# EAGLE schematic E-P-206-R2.0.0_Fuel_Cell_Controller (EAGLE 7.7.0)

## Sheet 1 of 3: Connectors
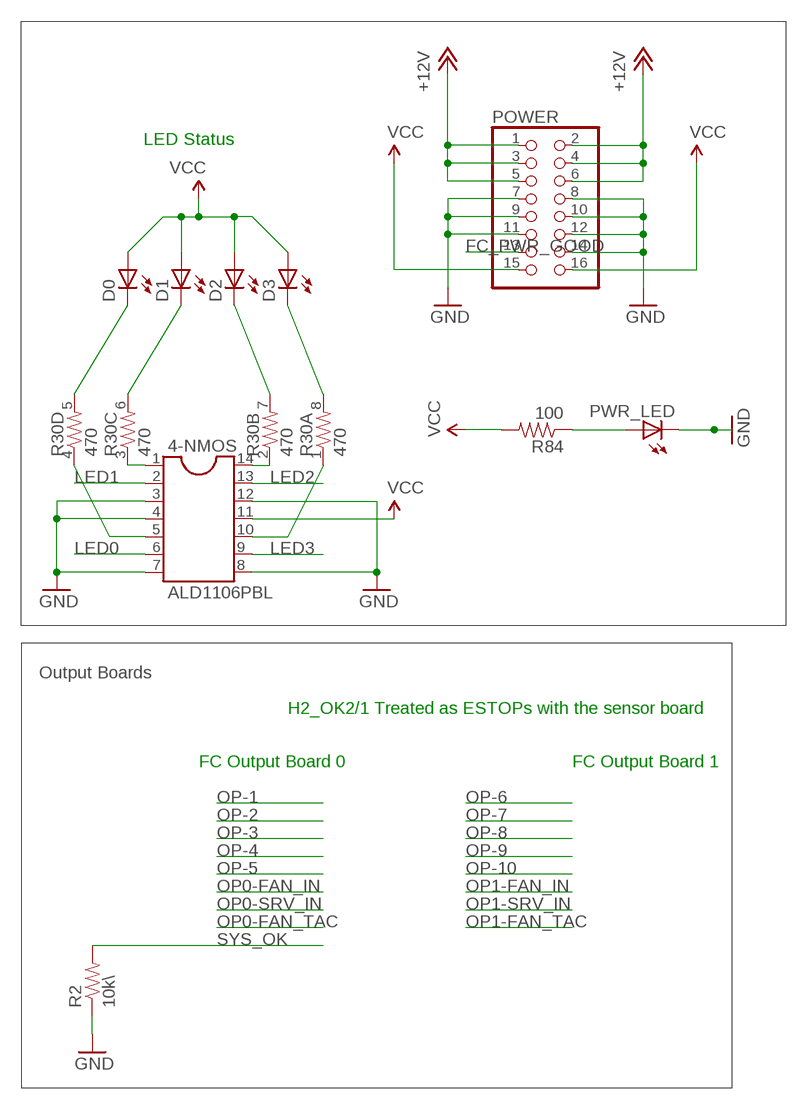
[diagram p0: schematic, sheet 1]

### Parts
4-NMOS  ALD1106PBL  DIL14SOIC  [SOIC-14]
D0  LED1206  [LED-1206]
D1  LED1206  [LED-1206]
D2  LED1206  [LED-1206]
D3  LED1206  [LED-1206]
POWER  PINHD-2X8  [2X08]
PWR_LED  LED1206  [LED-1206]
R2  10k\  RESISTOR0603-RES  [0603-RES]
R30  470  RESISTOR-ARRAY0603-ARV  [0603-ARV]
R84  100  RESISTOR0603-RES  [0603-RES]

### Nets
+12V: POWER.1 POWER.2 POWER.3 POWER.4 POWER.5 POWER.6 ; also sheet 2,3
FC_PWR_GOOD: POWER.13
GND: 4-NMOS.3 4-NMOS.4 4-NMOS.7 4-NMOS.8 4-NMOS.12 POWER.7 POWER.8 POWER.9 POWER.10 POWER.11 POWER.12 POWER.14 PWR_LED.C R2.1 ; also sheet 2,3
LED0: 4-NMOS.6 ; also sheet 2
LED0_O: D0.C R30.5
LED1: 4-NMOS.2 ; also sheet 2
LED1_O: D1.C R30.6
LED2: 4-NMOS.13 ; also sheet 2
LED2_O: D2.C R30.7
LED3: 4-NMOS.9 ; also sheet 2
LED3_O: D3.C R30.8
N$2: 4-NMOS.5 R30.4
N$4: 4-NMOS.1 R30.3
N$7: 4-NMOS.14 R30.2
N$8: 4-NMOS.10 R30.1
N$17: PWR_LED.A R84.1
SYS_OK: R2.2 ; also sheet 2,3
VCC: 4-NMOS.11 D0.A D1.A D2.A D3.A POWER.15 POWER.16 R84.2 ; also sheet 2,3

### Notes on the sheet
- LED Status
- Output Boards
- H2_OK2/1 Treated as ESTOPs with the sensor board
- FC Output Board 0 | FC Output Board 1

## Sheet 2 of 3: MCU
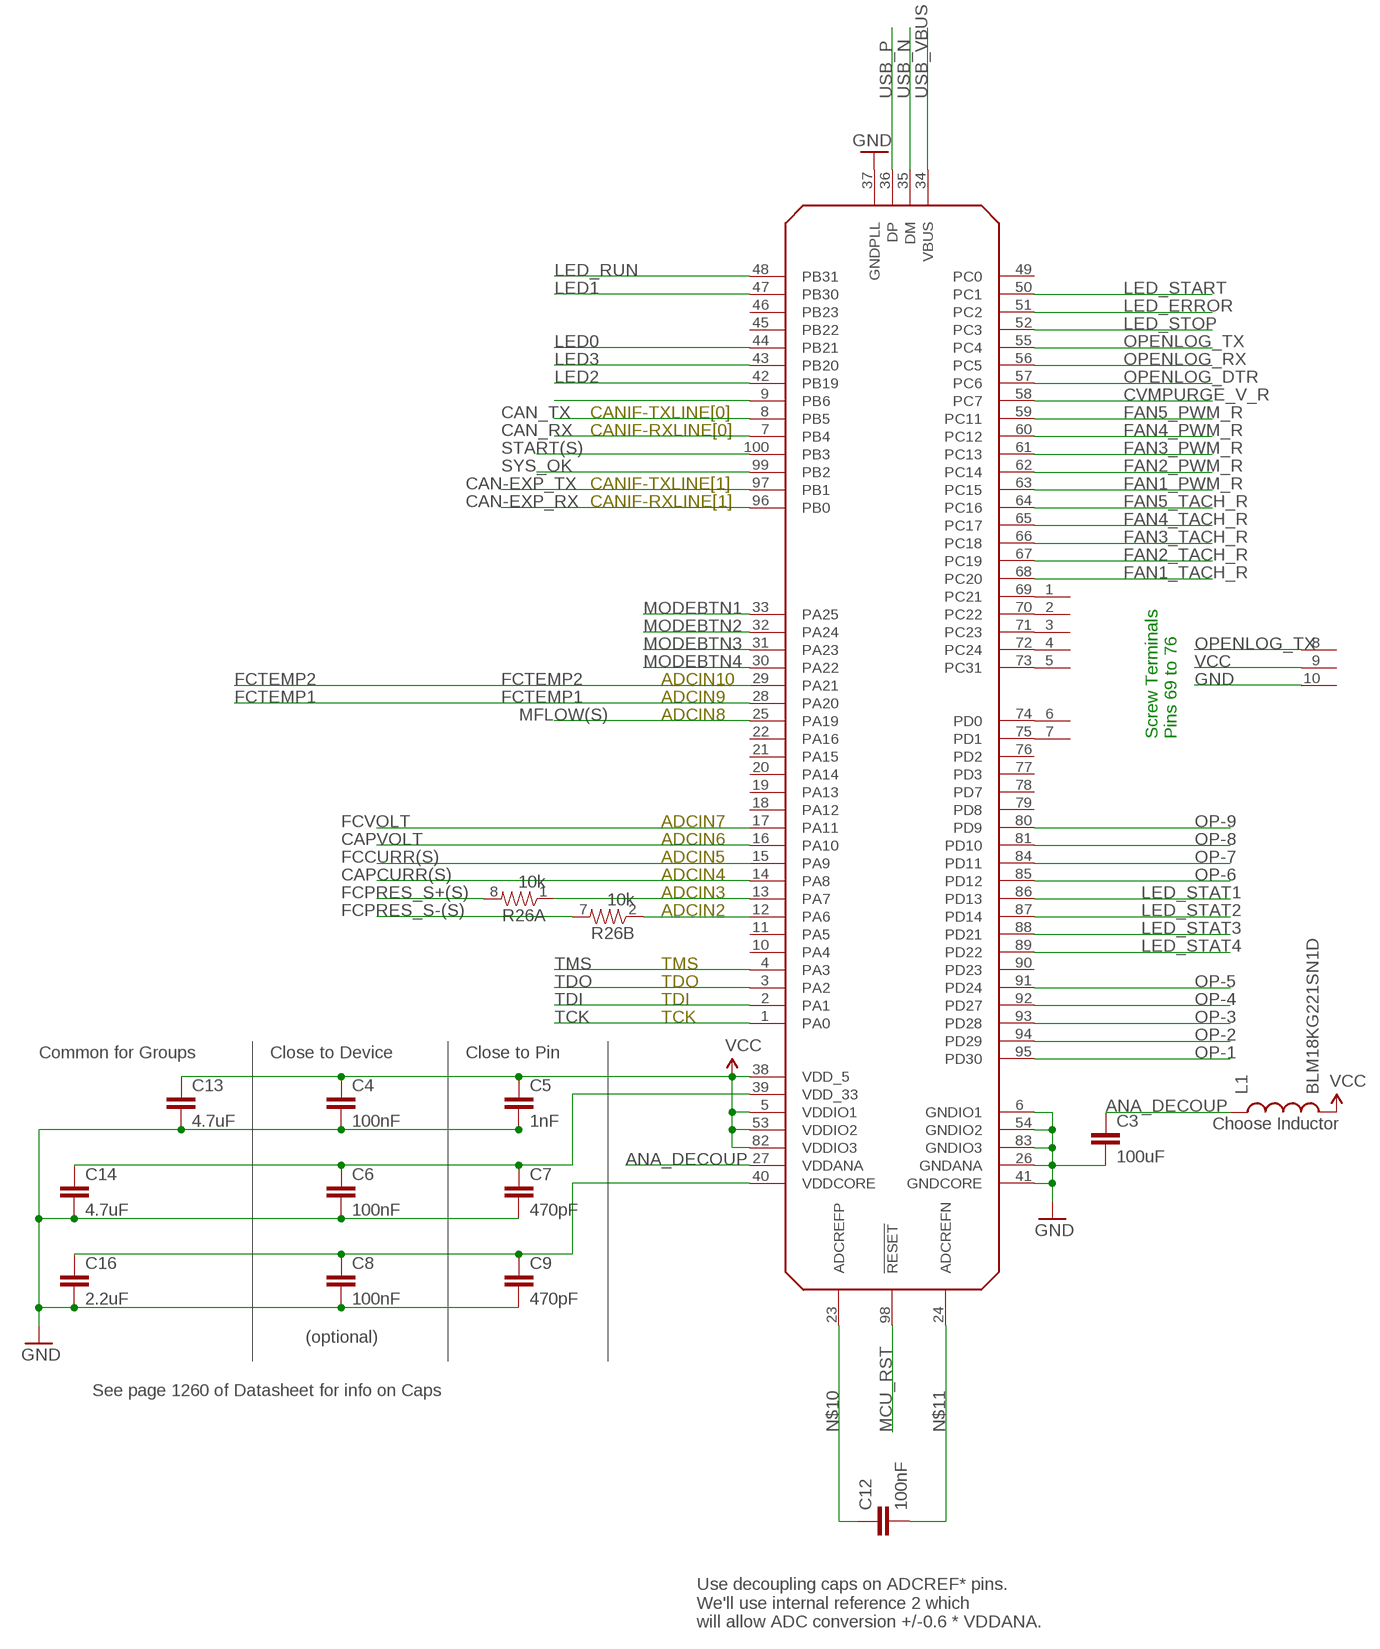
[diagram p1: schematic, sheet 2, part 1 of 2]
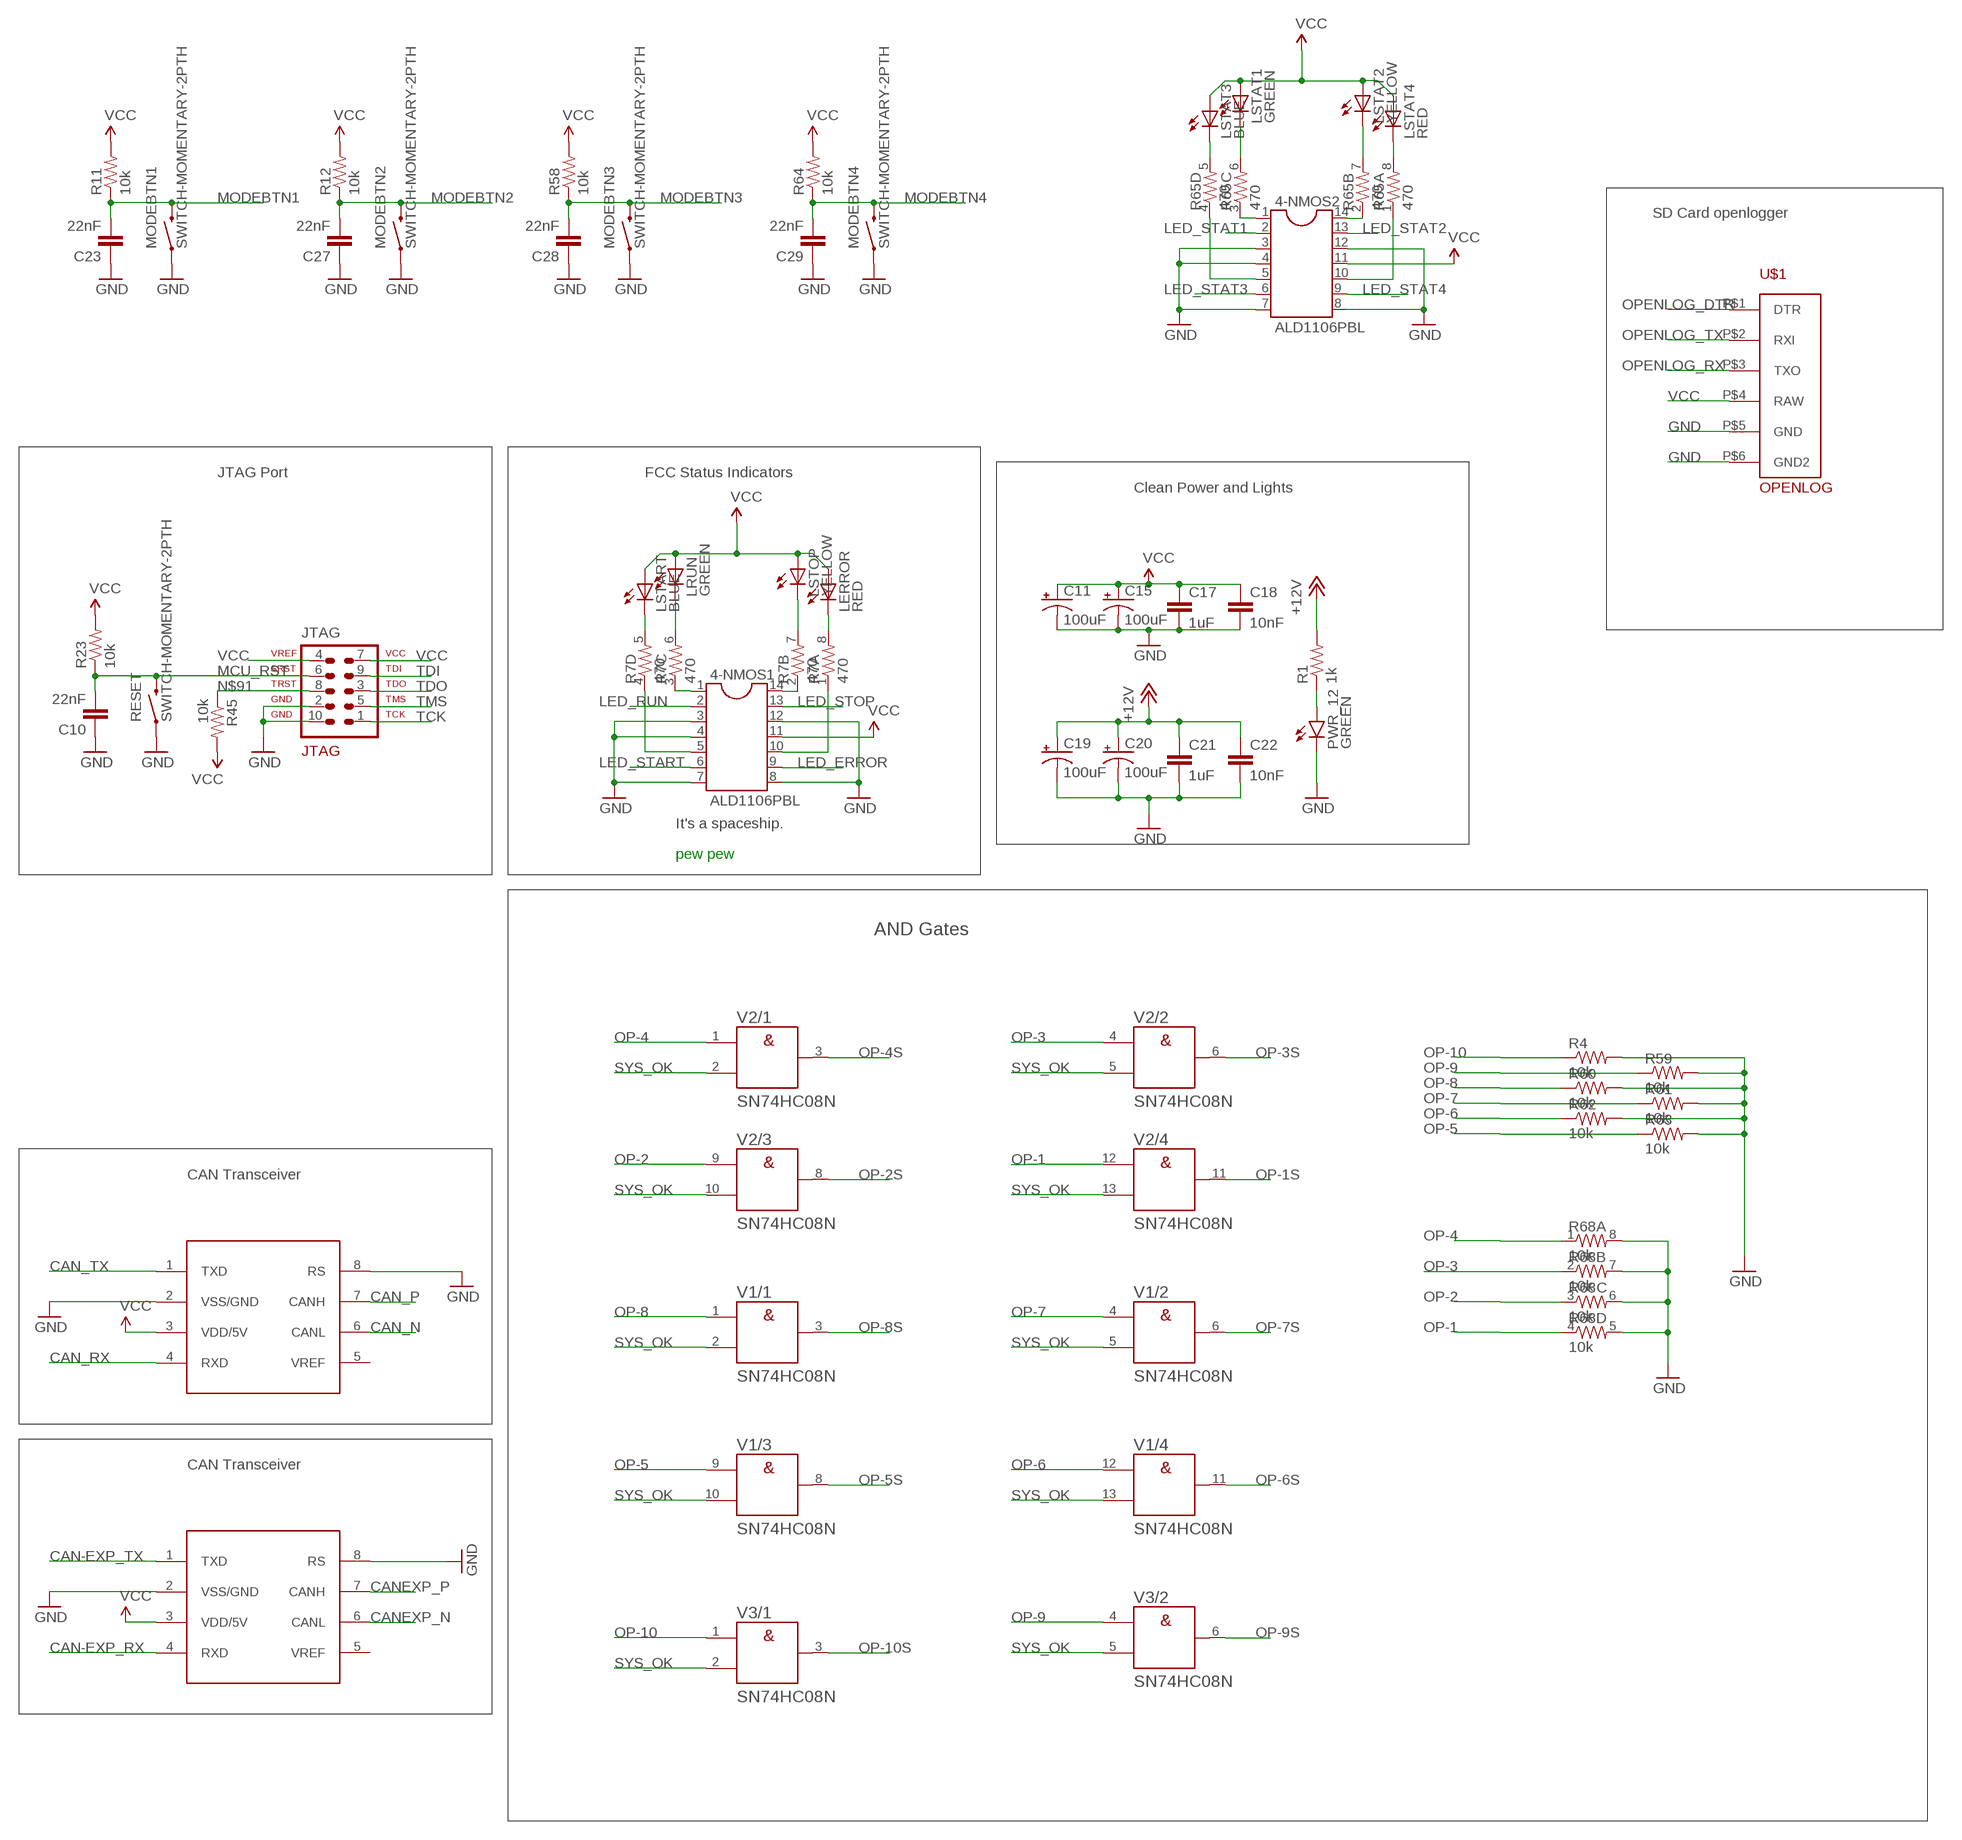
[diagram p2: schematic, sheet 2, part 2 of 2]

### Parts
4-NMOS1  ALD1106PBL  DIL14SOIC  [SOIC-14]
4-NMOS2  ALD1106PBL  DIL14SOIC  [SOIC-14]
C3  100uF  CAP0805  [0805]
C4  100nF  CAP0603-CAP  [0603-CAP]
C5  1nF  CAP0603-CAP  [0603-CAP]
C6  100nF  CAP0603-CAP  [0603-CAP]
C7  470pF  CAP0603-CAP  [0603-CAP]
C8  100nF  CAP0603-CAP  [0603-CAP]
C9  470pF  CAP0603-CAP  [0603-CAP]
C10  22nF  CAP0603-CAP  [0603-CAP]
C11  100uF  CAP_POLC  [PANASONIC_C]
C12  100nF  CAP0805  [0805]
C13  4.7uF  CAP0805  [0805]
C14  4.7uF  CAP0805  [0805]
C15  100uF  CAP_POLC  [PANASONIC_C]
C16  2.2uF  CAP0805  [0805]
C17  1uF  CAP0805  [0805]
C18  10nF  CAP0603-CAP  [0603-CAP]
C19  100uF  CAP_POLC  [PANASONIC_C]
C20  100uF  CAP_POLC  [PANASONIC_C]
C21  1uF  CAP0805  [0805]
C22  10nF  CAP0603-CAP  [0603-CAP]
C23  22nF  CAP0603-CAP  [0603-CAP]
C27  22nF  CAP0603-CAP  [0603-CAP]
C28  22nF  CAP0603-CAP  [0603-CAP]
C29  22nF  CAP0603-CAP  [0603-CAP]
JTAG  2x5  AVR-JTAG-10  [AVR-JTAG-10]
L1  BLM18KG221SN1D  INDUCTOR0603  [0603]
LERROR  RED  LED1206  [LED-1206]
LRUN  GREEN  LED1206  [LED-1206]
LSTART  BLUE  LED1206  [LED-1206]
LSTAT1  GREEN  LED1206  [LED-1206]
LSTAT2  YELLOW  LED1206  [LED-1206]
LSTAT3  BLUE  LED1206  [LED-1206]
LSTAT4  RED  LED1206  [LED-1206]
LSTOP  YELLOW  LED1206  [LED-1206]
MCU  AT32UC3C1512  [TQFP100]
MODEBTN1  SWITCH-MOMENTARY-2PTH  [TACTILE-PTH]
MODEBTN2  SWITCH-MOMENTARY-2PTH  [TACTILE-PTH]
MODEBTN3  SWITCH-MOMENTARY-2PTH  [TACTILE-PTH]
MODEBTN4  SWITCH-MOMENTARY-2PTH  [TACTILE-PTH]
PWR_12  GREEN  LED1206  [LED-1206]
R1  1k  RESISTOR0603-RES  [0603-RES]
R4  10k  RESISTOR0603-RES  [0603-RES]
R7  470  RESISTOR-ARRAY0603-ARV  [0603-ARV]
R11  10k  RESISTOR0603-RES  [0603-RES]
R12  10k  RESISTOR0603-RES  [0603-RES]
R23  10k  RESISTOR0603-RES  [0603-RES]
R26  10k  RESISTOR-ARRAY0603-ARV  [0603-ARV]
R45  10k  RESISTOR0603-RES  [0603-RES]
R58  10k  RESISTOR0603-RES  [0603-RES]
R59  10k  RESISTOR0603-RES  [0603-RES]
R60  10k  RESISTOR0603-RES  [0603-RES]
R61  10k  RESISTOR0603-RES  [0603-RES]
R62  10k  RESISTOR0603-RES  [0603-RES]
R63  10k  RESISTOR0603-RES  [0603-RES]
R64  10k  RESISTOR0603-RES  [0603-RES]
R65  470  RESISTOR-ARRAY0603-ARV  [0603-ARV]
R68  10k  RESISTOR-ARRAY0603-ARV  [0603-ARV]
RESET  SWITCH-MOMENTARY-2PTH  [TACTILE-PTH]
U$1  OPENLOG  [OPENLOG]
U$2  10X1PCBBLOCK  [10X1PCBBLOCK]
U$4  MCP2551  MCP2551SOIC  [8-SOIC]
U$36  MCP2551  MCP2551SOIC  [8-SOIC]
V1  SN74HC08N  7408N  [DIL14]
V2  SN74HC08N  7408N  [DIL14]
V3  SN74HC08N  7408N  [DIL14]

### Nets
+12V: C19.+ C20.+ C21.1 C22.1 R1.2 ; also sheet 1,3
ANA_DECOUP: C3.1 L1.1 MCU.27(VDDANA)
CAN-EXP_RX: MCU.96(PB0) U$36.4(RXD)
CAN-EXP_TX: MCU.97(PB1) U$36.1(TXD)
CAN_N: U$4.6(CANL)
CAN_P: U$4.7(CANH)
CAN_RX: MCU.7(PB4) U$4.4(RXD)
CAN_TX: MCU.8(PB5) U$4.1(TXD)
CANEXP_N: U$36.6(CANL)
CANEXP_P: U$36.7(CANH)
CAPCURR(S): MCU.14(PA8) ; also sheet 3
CAPVOLT: MCU.16(PA10) ; also sheet 3
CVMPURGE_V_R: MCU.58(PC7) ; also sheet 3
FAN1_PWM_R: MCU.63(PC15) ; also sheet 3
FAN1_TACH_R: MCU.68(PC20) ; also sheet 3
FAN2_PWM_R: MCU.62(PC14) ; also sheet 3
FAN2_TACH_R: MCU.67(PC19) ; also sheet 3
FAN3_PWM_R: MCU.61(PC13) ; also sheet 3
FAN3_TACH_R: MCU.66(PC18) ; also sheet 3
FAN4_PWM_R: MCU.60(PC12) ; also sheet 3
FAN4_TACH_R: MCU.65(PC17) ; also sheet 3
FAN5_PWM_R: MCU.59(PC11) ; also sheet 3
FAN5_TACH_R: MCU.64(PC16) ; also sheet 3
FCCURR(S): MCU.15(PA9) ; also sheet 3
FCPRES_S+(S): R26.8 ; also sheet 3
FCPRES_S-(S): R26.7 ; also sheet 3
FCTEMP1: MCU.28(PA20) ; also sheet 3
FCTEMP2: MCU.29(PA21) ; also sheet 3
FCVOLT: MCU.17(PA11) ; also sheet 3
GND: 4-NMOS1.3 4-NMOS1.4 4-NMOS1.7 4-NMOS1.8 4-NMOS1.12 4-NMOS2.8 4-NMOS2.12 C3.2 C4.2 C5.2 C6.2 C7.2 C8.2 C9.2 C10.1 C11.- C13.2 C14.2 C15.- C16.2 C17.2 C18.2 C19.- C20.- C21.2 C22.2 C23.1 C27.1 C28.1 C29.1 JTAG.2 JTAG.10 MCU.6(GNDIO1) MCU.26(GNDANA) MCU.37(GNDPLL) MCU.41(GNDCORE) MCU.54(GNDIO2) MCU.83(GNDIO3) MODEBTN1.1 MODEBTN2.1 MODEBTN3.1 MODEBTN4.1 PWR_12.C R4.2 R59.2 R60.2 R61.2 R62.2 R63.2 R68.5 R68.6 R68.7 R68.8 RESET.1 U$1.P$5(GND) U$1.P$6(GND2) U$2.10 U$4.2(VSS/GND) U$4.8(RS) U$36.2(VSS/GND) U$36.8(RS) ; also sheet 1,3
LED0: MCU.44(PB21) ; also sheet 1
LED1: MCU.47(PB30) ; also sheet 1
LED2: MCU.42(PB19) ; also sheet 1
LED3: MCU.43(PB20) ; also sheet 1
LED_ERROR: 4-NMOS1.9 MCU.51(PC2)
LED_RUN: 4-NMOS1.2 MCU.48(PB31)
LED_START: 4-NMOS1.6 MCU.50(PC1)
LED_STAT1: 4-NMOS2.2 MCU.86(PD13)
LED_STAT2: 4-NMOS2.13 MCU.87(PD14)
LED_STAT3: 4-NMOS2.3 4-NMOS2.4 4-NMOS2.6 4-NMOS2.7 MCU.88(PD21) ; supply symbol labelled GND
LED_STAT4: 4-NMOS2.9 MCU.89(PD22)
LED_STOP: 4-NMOS1.13 MCU.52(PC3)
MCU_RST: C10.2 JTAG.6 MCU.98(!RESET) R23.1 RESET.3 ; also sheet 3
MFLOW(S): MCU.25(PA19) ; also sheet 3
MODEBTN1: C23.2 MCU.33(PA25) MODEBTN1.3 R11.1
MODEBTN2: C27.2 MCU.32(PA24) MODEBTN2.3 R12.1
MODEBTN3: C28.2 MCU.31(PA23) MODEBTN3.3 R58.1
MODEBTN4: C29.2 MCU.30(PA22) MODEBTN4.3 R64.1
N$3: MCU.12(PA6) R26.2
N$5: MCU.13(PA7) R26.1
N$6: C6.1 C7.1 C14.1 MCU.39(VDD_33)
N$9: C8.1 C9.1 C16.1 MCU.40(VDDCORE)
N$10: C12.1 MCU.23(ADCREFP)
N$11: C12.2 MCU.24(ADCREFN)
N$22: MCU.69(PC21) U$2.1
N$23: MCU.70(PC22) U$2.2
N$24: MCU.71(PC23) U$2.3
N$25: LSTART.C R7.5
N$26: LRUN.C R7.6
N$30: MCU.72(PC24) U$2.4
N$31: MCU.73(PC31) U$2.5
N$32: 4-NMOS1.5 R7.4
N$33: 4-NMOS1.1 R7.3
N$34: PWR_12.A R1.1
N$36: MCU.74(PD0) U$2.6
N$37: MCU.75(PD1) U$2.7
N$39: 4-NMOS2.5 R65.4
N$40: 4-NMOS2.1 R65.3
N$41: 4-NMOS2.14 R65.2
N$42: 4-NMOS2.10 R65.1
N$43: LSTAT3.C R65.5
N$44: 4-NMOS1.14 R7.2
N$45: 4-NMOS1.10 R7.1
N$46: LSTOP.C R7.7
N$47: LERROR.C R7.8
N$50: LSTAT1.C R65.6
N$52: LSTAT2.C R65.7
N$55: LSTAT4.C R65.8
N$66: MCU.9(PB6)
N$91: JTAG.8 R45.1
OP-1: MCU.95(PD30) R68.4 V2.12(/4:A) ; also sheet 1
OP-1S: V2.11(/4:Y) ; also sheet 3
OP-2: MCU.94(PD29) R68.3 V2.9(/3:A) ; also sheet 1
OP-2S: V2.8(/3:Y) ; also sheet 3
OP-3: MCU.93(PD28) R68.2 V2.4(/2:A) ; also sheet 1
OP-3S: V2.6(/2:Y) ; also sheet 3
OP-4: MCU.92(PD27) R68.1 V2.1(/1:A) ; also sheet 1
OP-4S: V2.3(/1:Y) ; also sheet 3
OP-5: MCU.91(PD24) R63.1 V1.9(/3:A) ; also sheet 1
OP-5S: V1.8(/3:Y) ; also sheet 3
OP-6: MCU.85(PD12) R62.1 V1.12(/4:A) ; also sheet 1
OP-6S: V1.11(/4:Y) ; also sheet 3
OP-7: MCU.84(PD11) R61.1 V1.4(/2:A) ; also sheet 1
OP-7S: V1.6(/2:Y) ; also sheet 3
OP-8: MCU.81(PD10) R60.1 V1.1(/1:A) ; also sheet 1
OP-8S: V1.3(/1:Y) ; also sheet 3
OP-9: MCU.80(PD9) R59.1 V3.4(/2:A) ; also sheet 1
OP-9S: V3.6(/2:Y) ; also sheet 3
OP-10: R4.1 V3.1(/1:A) ; also sheet 1
OP-10S: V3.3(/1:Y) ; also sheet 3
OPENLOG_DTR: MCU.57(PC6) U$1.P$1(DTR)
OPENLOG_RX: MCU.56(PC5) U$1.P$3(TXO)
OPENLOG_TX: MCU.55(PC4) U$1.P$2(RXI) U$2.8
START(S): MCU.100(PB3) ; also sheet 3
SYS_OK: MCU.99(PB2) V1.2(/1:B) V1.5(/2:B) V1.10(/3:B) V1.13(/4:B) V2.2(/1:B) V2.5(/2:B) V2.10(/3:B) V2.13(/4:B) V3.2(/1:B) V3.5(/2:B) ; also sheet 1,3
TCK: JTAG.1 MCU.1(PA0)
TDI: JTAG.9 MCU.2(PA1)
TDO: JTAG.3 MCU.3(PA2)
TMS: JTAG.5 MCU.4(PA3)
USB_N: MCU.35(DM)
USB_P: MCU.36(DP)
USB_VBUS: MCU.34(VBUS)
VCC: 4-NMOS1.11 4-NMOS2.11 C4.1 C5.1 C11.+ C13.1 C15.+ C17.1 C18.1 JTAG.4 JTAG.7 L1.2 LERROR.A LRUN.A LSTART.A LSTAT1.A LSTAT2.A LSTAT3.A LSTAT4.A LSTOP.A MCU.5(VDDIO1) MCU.38(VDD_5) MCU.53(VDDIO2) MCU.82(VDDIO3) R11.2 R12.2 R23.2 R45.2 R58.2 R64.2 U$1.P$4(RAW) U$2.9 U$4.3(VDD/5V) U$36.3(VDD/5V) ; also sheet 1,3
Unconnected: MCU.10(PA4) MCU.11(PA5) MCU.18(PA12) MCU.19(PA13) MCU.20(PA14) MCU.21(PA15) MCU.22(PA16) MCU.45(PB22) MCU.46(PB23) MCU.49(PC0) MCU.76(PD2) MCU.77(PD3) MCU.78(PD7) MCU.79(PD8) MCU.90(PD23) R26.3 R26.4 R26.5 R26.6 U$4.5(VREF) U$36.5(VREF) V3.8(/3:Y) V3.9(/3:A) V3.10(/3:B) V3.11(/4:Y) V3.12(/4:A) V3.13(/4:B)

### Notes on the sheet
- SD Card openlogger
- JTAG Port | FCC Status Indicators
- Clean Power and Lights
- CANIF-TXLINE[0]
- CANIF-RXLINE[0]
- It's a spaceship.
- CANIF-TXLINE[1] | pew pew
- CANIF-RXLINE[1]
- AND Gates
- ADCIN10
- ADCIN9
- ADCIN8
- Screw Terminals
  Pins 69 to 76
- ADCIN7
- ADCIN6
- ADCIN5 | CAN Transceiver
- ADCIN4
- ADCIN3
- ADCIN2
- TMS
- TDO
- TDI
- TCK
- Common for Groups | Close to Device | Close to Pin
- Choose Inductor
- CAN Transceiver
- (optional)
- See page 1260 of Datasheet for info on Caps
- Use decoupling caps on ADCREF* pins.
  We'll use internal reference 2 which 
  will allow ADC conversion +/-0.6 * VDDANA.

## Sheet 3 of 3: Ethernet I/O
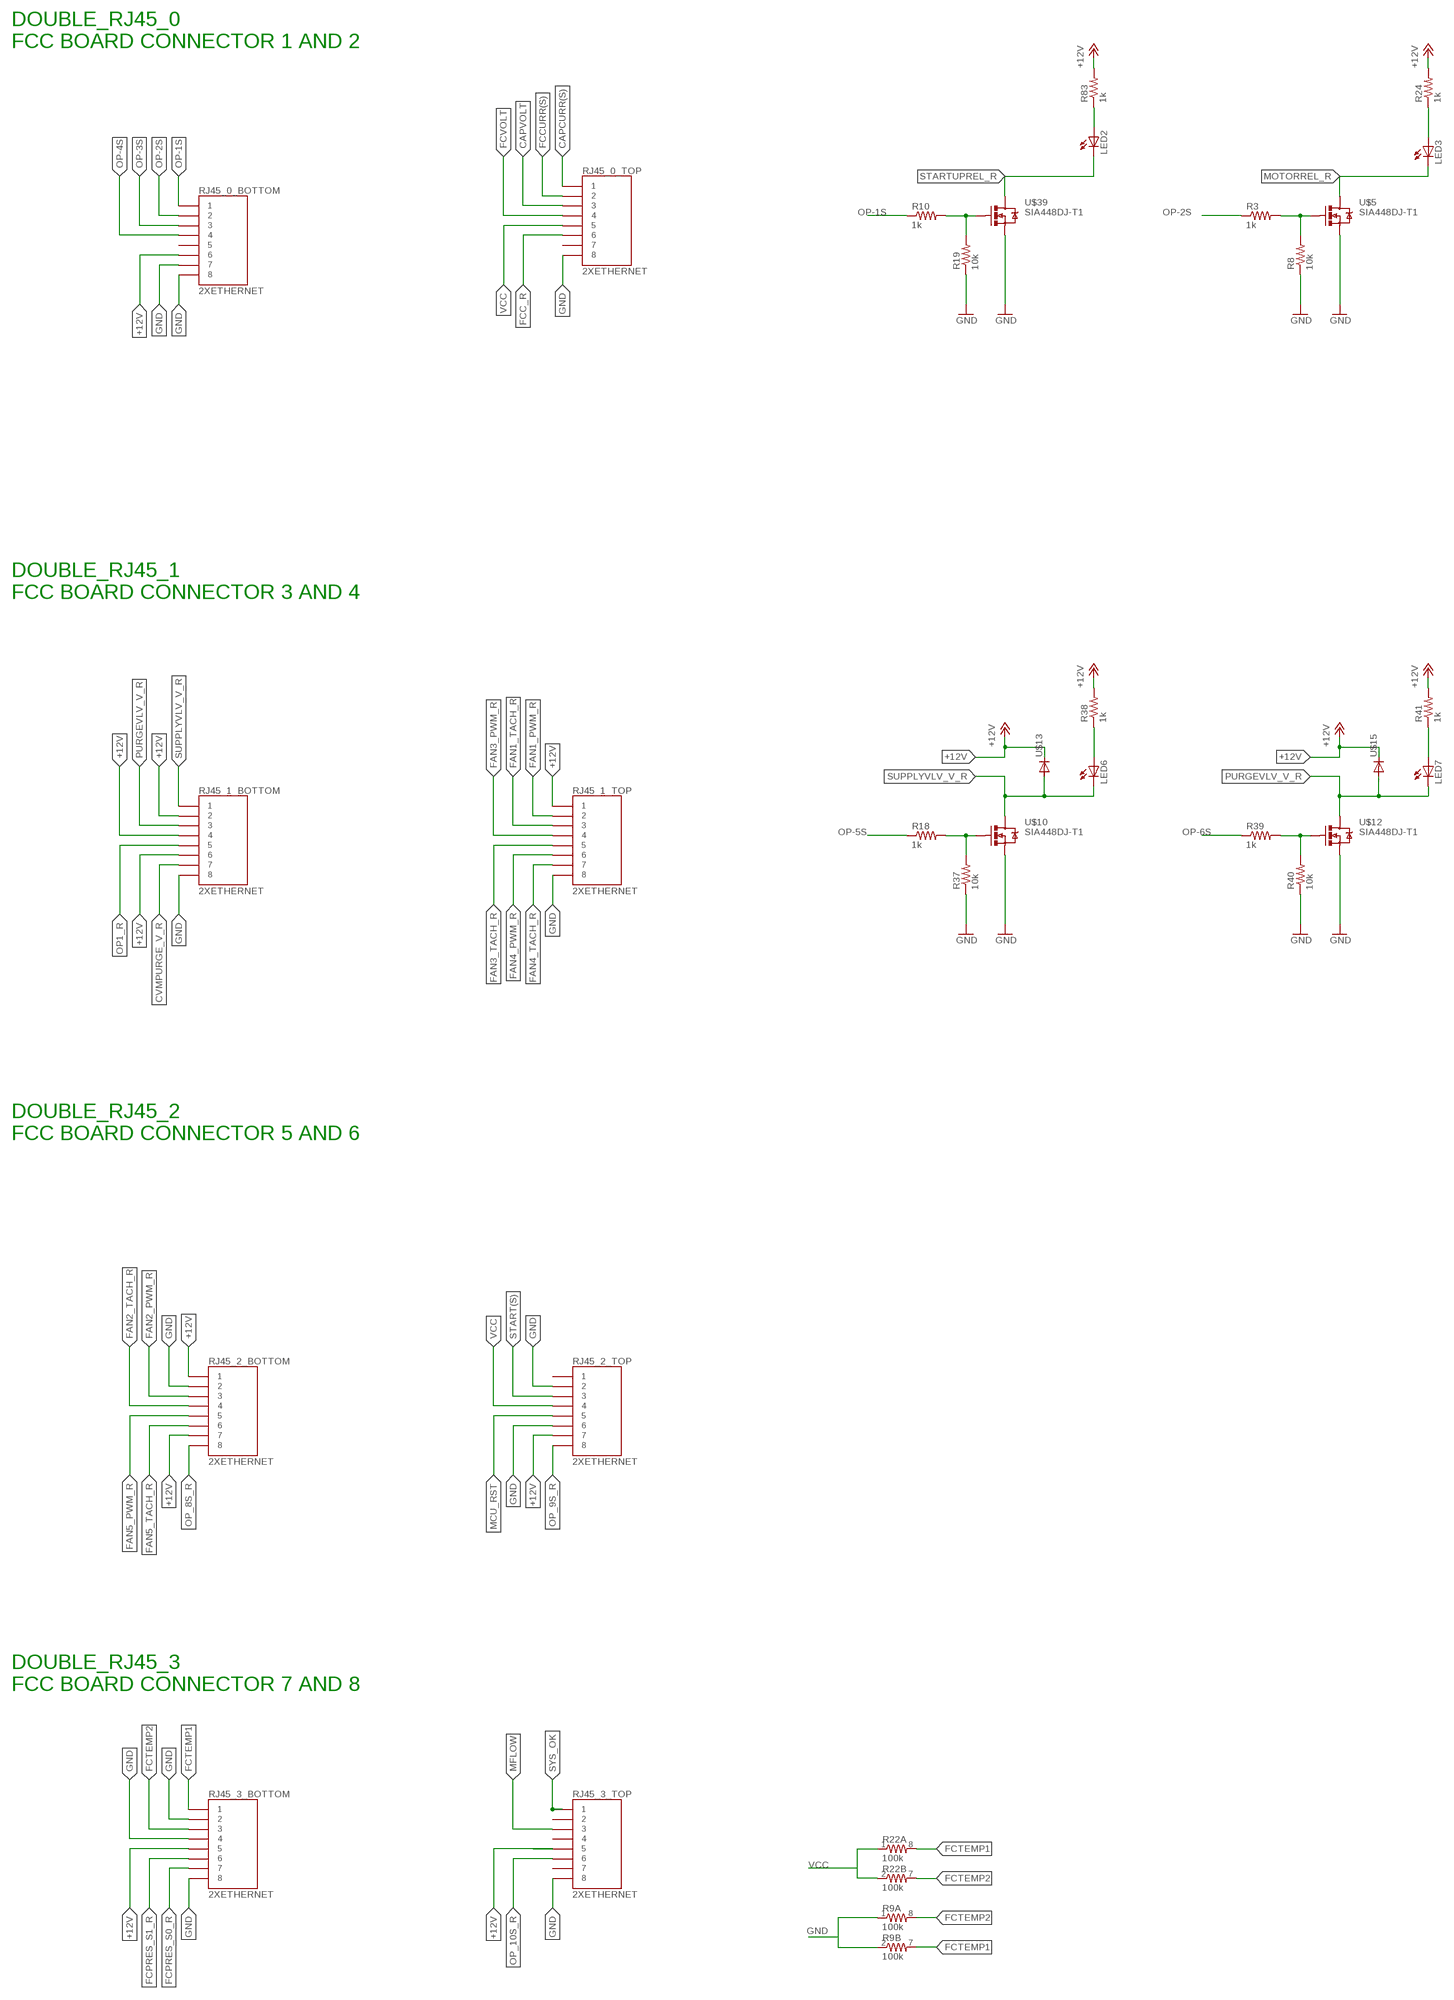
[diagram p3: schematic, sheet 3, part 1 of 2]
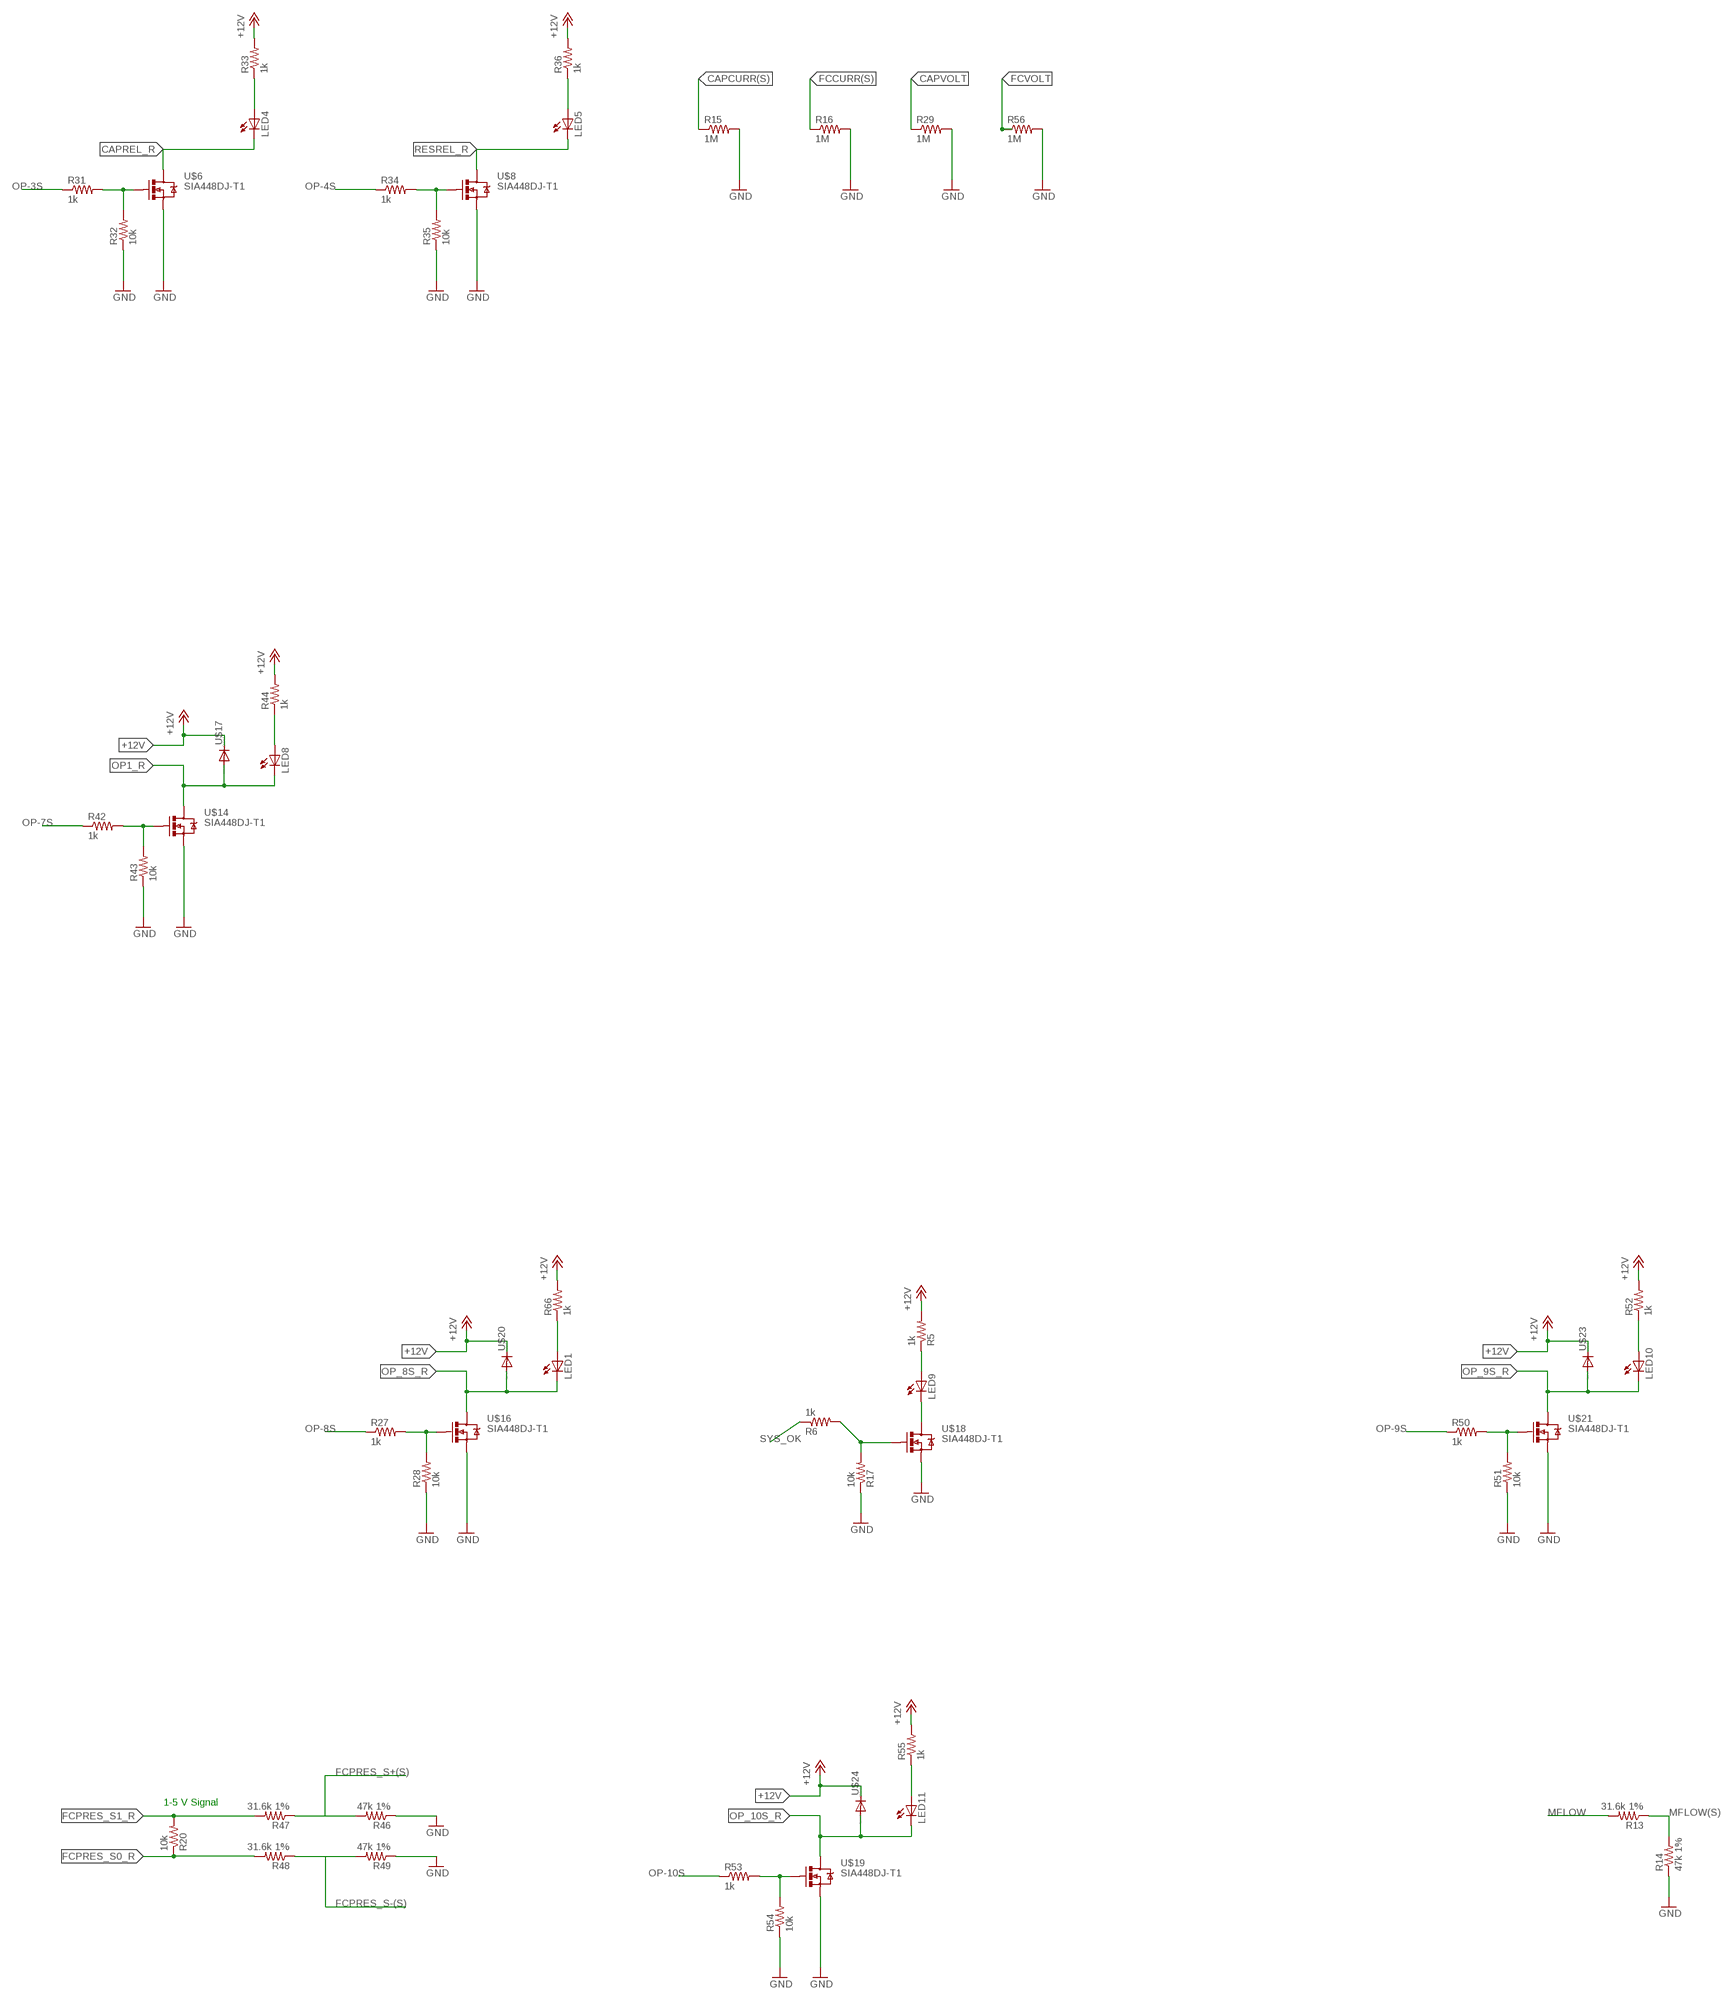
[diagram p4: schematic, sheet 3, part 2 of 2]

### Parts
LED1  LED1206  [LED-1206]
LED2  LED1206  [LED-1206]
LED3  LED1206  [LED-1206]
LED4  LED1206  [LED-1206]
LED5  LED1206  [LED-1206]
LED6  LED1206  [LED-1206]
LED7  LED1206  [LED-1206]
LED8  LED1206  [LED-1206]
LED9  LED1206  [LED-1206]
LED10  LED1206  [LED-1206]
LED11  LED1206  [LED-1206]
R3  1k  RESISTOR0603-RES  [0603-RES]
R5  1k  RESISTOR0603-RES  [0603-RES]
R6  1k  RESISTOR0603-RES  [0603-RES]
R8  10k  RESISTOR0603-RES  [0603-RES]
R9  100k  RESISTOR-ARRAY0603-ARV  [0603-ARV]
R10  1k  RESISTOR0603-RES  [0603-RES]
R13  31.6k 1%  RESISTOR0603-RES  [0603-RES]
R14  47k 1%  RESISTOR0603-RES  [0603-RES]
R15  1M  R-US_R0805  [R0805]
R16  1M  R-US_R0805  [R0805]
R17  10k  RESISTOR0603-RES  [0603-RES]
R18  1k  RESISTOR0603-RES  [0603-RES]
R19  10k  RESISTOR0603-RES  [0603-RES]
R20  10k  RESISTOR0603-RES  [0603-RES]
R22  100k  RESISTOR-ARRAY0603-ARV  [0603-ARV]
R24  1k  RESISTOR0603-RES  [0603-RES]
R27  1k  RESISTOR0603-RES  [0603-RES]
R28  10k  RESISTOR0603-RES  [0603-RES]
R29  1M  R-US_R0805  [R0805]
R31  1k  RESISTOR0603-RES  [0603-RES]
R32  10k  RESISTOR0603-RES  [0603-RES]
R33  1k  RESISTOR0603-RES  [0603-RES]
R34  1k  RESISTOR0603-RES  [0603-RES]
R35  10k  RESISTOR0603-RES  [0603-RES]
R36  1k  RESISTOR0603-RES  [0603-RES]
R37  10k  RESISTOR0603-RES  [0603-RES]
R38  1k  RESISTOR0603-RES  [0603-RES]
R39  1k  RESISTOR0603-RES  [0603-RES]
R40  10k  RESISTOR0603-RES  [0603-RES]
R41  1k  RESISTOR0603-RES  [0603-RES]
R42  1k  RESISTOR0603-RES  [0603-RES]
R43  10k  RESISTOR0603-RES  [0603-RES]
R44  1k  RESISTOR0603-RES  [0603-RES]
R46  47k 1%  RESISTOR0603-RES  [0603-RES]
R47  31.6k 1%  RESISTOR0603-RES  [0603-RES]
R48  31.6k 1%  RESISTOR0603-RES  [0603-RES]
R49  47k 1%  RESISTOR0603-RES  [0603-RES]
R50  1k  RESISTOR0603-RES  [0603-RES]
R51  10k  RESISTOR0603-RES  [0603-RES]
R52  1k  RESISTOR0603-RES  [0603-RES]
R53  1k  RESISTOR0603-RES  [0603-RES]
R54  10k  RESISTOR0603-RES  [0603-RES]
R55  1k  RESISTOR0603-RES  [0603-RES]
R56  1M  R-US_R0805  [R0805]
R66  1k  RESISTOR0603-RES  [0603-RES]
R83  1k  RESISTOR0603-RES  [0603-RES]
RJ45_0_  2XETHERNET  [2XETHERNET]
RJ45_1_  2XETHERNET  [2XETHERNET]
RJ45_2_  2XETHERNET  [2XETHERNET]
RJ45_3_  2XETHERNET  [2XETHERNET]
U$5  SIA448DJ-T1  SIA426DJ  [SC70-6L]
U$6  SIA448DJ-T1  SIA426DJ  [SC70-6L]
U$8  SIA448DJ-T1  SIA426DJ  [SC70-6L]
U$10  SIA448DJ-T1  SIA426DJ  [SC70-6L]
U$12  SIA448DJ-T1  SIA426DJ  [SC70-6L]
U$13  DIODE-DO214AC  [DO214AC]
U$14  SIA448DJ-T1  SIA426DJ  [SC70-6L]
U$15  DIODE-DO214AC  [DO214AC]
U$16  SIA448DJ-T1  SIA426DJ  [SC70-6L]
U$17  DIODE-DO214AC  [DO214AC]
U$18  SIA448DJ-T1  SIA426DJ  [SC70-6L]
U$19  SIA448DJ-T1  SIA426DJ  [SC70-6L]
U$20  DIODE-DO214AC  [DO214AC]
U$21  SIA448DJ-T1  SIA426DJ  [SC70-6L]
U$23  DIODE-DO214AC  [DO214AC]
U$24  DIODE-DO214AC  [DO214AC]
U$39  SIA448DJ-T1  SIA426DJ  [SC70-6L]

### Nets
+12V: R5.2 R24.2 R33.2 R36.2 R38.2 R41.2 R44.2 R52.2 R55.2 R66.2 R83.2 RJ45_0_.B_6 RJ45_1_.B_2 RJ45_1_.B_4 RJ45_1_.B_6 RJ45_1_.T_1 RJ45_2_.B_1 RJ45_2_.B_7 RJ45_2_.T_7 RJ45_3_.B_5 RJ45_3_.T_5 U$13.C U$15.C U$17.C U$20.C U$23.C U$24.C ; also sheet 1,2
CAPCURR(S): R15.1 RJ45_0_.T_1 ; also sheet 2
CAPREL_R: LED4.C U$6.D
CAPVOLT: R29.1 RJ45_0_.T_3 ; also sheet 2
CVMPURGE_V_R: RJ45_1_.B_7 ; also sheet 2
FAN1_PWM_R: RJ45_1_.T_2 ; also sheet 2
FAN1_TACH_R: RJ45_1_.T_3 ; also sheet 2
FAN2_PWM_R: RJ45_2_.B_3 ; also sheet 2
FAN2_TACH_R: RJ45_2_.B_4 ; also sheet 2
FAN3_PWM_R: RJ45_1_.T_4 ; also sheet 2
FAN3_TACH_R: RJ45_1_.T_5 ; also sheet 2
FAN4_PWM_R: RJ45_1_.T_6 ; also sheet 2
FAN4_TACH_R: RJ45_1_.T_7 ; also sheet 2
FAN5_PWM_R: RJ45_2_.B_5 ; also sheet 2
FAN5_TACH_R: RJ45_2_.B_6 ; also sheet 2
FCC_R: RJ45_0_.T_6
FCCURR(S): R16.1 RJ45_0_.T_2 ; also sheet 2
FCPRES_S0_R: R20.1 R48.2 RJ45_3_.B_7
FCPRES_S1_R: R20.2 R47.2 RJ45_3_.B_6
FCPRES_S+(S): R46.2 R47.1 ; also sheet 2
FCPRES_S-(S): R48.1 R49.2 ; also sheet 2
FCTEMP1: R9.7 R22.8 RJ45_3_.B_1 ; also sheet 2
FCTEMP2: R9.8 R22.7 RJ45_3_.B_3 ; also sheet 2
FCVOLT: R56.1 RJ45_0_.T_4 ; also sheet 2
GND: R8.1 R9.1 R9.2 R14.1 R15.2 R16.2 R17.1 R19.1 R28.1 R29.2 R32.1 R35.1 R37.1 R40.1 R43.1 R46.1 R49.1 R51.1 R54.1 R56.2 RJ45_0_.B_7 RJ45_0_.B_8 RJ45_0_.T_8 RJ45_1_.B_8 RJ45_1_.T_8 RJ45_2_.B_2 RJ45_2_.T_2 RJ45_2_.T_6 RJ45_3_.B_2 RJ45_3_.B_4 RJ45_3_.B_8 RJ45_3_.T_8 U$5.S@0(S) U$5.S@1(S) U$6.S@0(S) U$6.S@1(S) U$8.S@0(S) U$8.S@1(S) U$10.S@0(S) U$10.S@1(S) U$12.S@0(S) U$12.S@1(S) U$14.S@0(S) U$14.S@1(S) U$16.S@0(S) U$16.S@1(S) U$18.S@0(S) U$18.S@1(S) U$19.S@0(S) U$19.S@1(S) U$21.S@0(S) U$21.S@1(S) U$39.S@0(S) U$39.S@1(S) ; also sheet 1,2
MCU_RST: RJ45_2_.T_5 ; also sheet 2
MFLOW: R13.2 RJ45_3_.T_3
MFLOW(S): R13.1 R14.2 ; also sheet 2
MOTORREL_R: LED3.C U$5.D
N$14: LED9.A R5.1
N$15: R10.2 R19.2 U$39.G
N$16: LED9.C U$18.D
N$18: R3.2 R8.2 U$5.G
N$19: LED2.A R83.1
N$20: R31.2 R32.2 U$6.G
N$35: LED3.A R24.1
N$48: R34.2 R35.2 U$8.G
N$49: LED4.A R33.1
N$51: R18.2 R37.2 U$10.G
N$53: LED5.A R36.1
N$54: R27.2 R28.2 U$16.G
N$56: R39.2 R40.2 U$12.G
N$57: LED6.A R38.1
N$60: R42.2 R43.2 U$14.G
N$61: LED7.A R41.1
N$62: R50.2 R51.2 U$21.G
N$65: LED8.A R44.1
N$68: R53.2 R54.2 U$19.G
N$69: R6.2 R17.2 U$18.G
N$70: LED1.A R66.1
N$73: LED10.A R52.1
N$76: LED11.A R55.1
OP1_R: LED8.C RJ45_1_.B_5 U$14.D U$17.A
OP-1S: R10.1 RJ45_0_.B_1 ; also sheet 2
OP-2S: R3.1 RJ45_0_.B_2 ; also sheet 2
OP-3S: R31.1 RJ45_0_.B_3 ; also sheet 2
OP-4S: R34.1 RJ45_0_.B_4 ; also sheet 2
OP-5S: R18.1 ; also sheet 2
OP-6S: R39.1 ; also sheet 2
OP-7S: R42.1 ; also sheet 2
OP-8S: R27.1 ; also sheet 2
OP-9S: R50.1 ; also sheet 2
OP-10S: R53.1 ; also sheet 2
OP_8S_R: LED1.C RJ45_2_.B_8 U$16.D U$20.A
OP_9S_R: LED10.C RJ45_2_.T_8 U$21.D U$23.A
OP_10S_R: LED11.C RJ45_3_.T_6 U$19.D U$24.A
PURGEVLV_V_R: LED7.C RJ45_1_.B_3 U$12.D U$15.A
RESREL_R: LED5.C U$8.D
START(S): RJ45_2_.T_3 ; also sheet 2
STARTUPREL_R: LED2.C U$39.D
SUPPLYVLV_V_R: LED6.C RJ45_1_.B_1 U$10.D U$13.A
SYS_OK: R6.1 RJ45_3_.T_1 ; also sheet 1,2
VCC: R22.1 R22.2 RJ45_0_.T_5 RJ45_2_.T_4 ; also sheet 1,2
Unconnected: R9.3 R9.4 R9.5 R9.6 R22.3 R22.4 R22.5 R22.6 RJ45_0_.B_5 RJ45_0_.B_9(BTM_LED_0:A) RJ45_0_.B_10(BTM_LED_0:C) RJ45_0_.B_11(BTM_LED_1:A) RJ45_0_.B_12(BTM_LED_1:C) RJ45_0_.T_7 RJ45_0_.T_9(TOP_LED_0:A) RJ45_0_.T_10(TOP_LED_0:C) RJ45_0_.T_11(TOP_LED_1:A) RJ45_0_.T_12(TOP_LED_1:C) RJ45_1_.B_9(BTM_LED_0:A) RJ45_1_.B_10(BTM_LED_0:C) RJ45_1_.B_11(BTM_LED_1:A) RJ45_1_.B_12(BTM_LED_1:C) RJ45_1_.T_9(TOP_LED_0:A) RJ45_1_.T_10(TOP_LED_0:C) RJ45_1_.T_11(TOP_LED_1:A) RJ45_1_.T_12(TOP_LED_1:C) RJ45_2_.B_9(BTM_LED_0:A) RJ45_2_.B_10(BTM_LED_0:C) RJ45_2_.B_11(BTM_LED_1:A) RJ45_2_.B_12(BTM_LED_1:C) RJ45_2_.T_1 RJ45_2_.T_9(TOP_LED_0:A) RJ45_2_.T_10(TOP_LED_0:C) RJ45_2_.T_11(TOP_LED_1:A) RJ45_2_.T_12(TOP_LED_1:C) RJ45_3_.B_9(BTM_LED_0:A) RJ45_3_.B_10(BTM_LED_0:C) RJ45_3_.B_11(BTM_LED_1:A) RJ45_3_.B_12(BTM_LED_1:C) RJ45_3_.T_2 RJ45_3_.T_4 RJ45_3_.T_7 RJ45_3_.T_9(TOP_LED_0:A) RJ45_3_.T_10(TOP_LED_0:C) RJ45_3_.T_11(TOP_LED_1:A) RJ45_3_.T_12(TOP_LED_1:C)

### Notes on the sheet
- DOUBLE_RJ45_0
  FCC BOARD CONNECTOR 1 AND 2
- DOUBLE_RJ45_1
  FCC BOARD CONNECTOR 3 AND 4
- DOUBLE_RJ45_2
  FCC BOARD CONNECTOR 5 AND 6
- DOUBLE_RJ45_3
  FCC BOARD CONNECTOR 7 AND 8
- 1-5 V Signal

## Power pins joined to a net without a drawn wire
+UB: V1.14(/+UB:+UB) V2.14(/+UB:+UB) V3.14(/+UB:+UB)
-UB: V1.7(/-UB:-UB) V2.7(/-UB:-UB) V3.7(/-UB:-UB)

## Library data of the parts
4-NMOS 4-NMOS1 4-NMOS2 = Shell2013:DIL14: Dual In Line / Socket
C3-C10 C18 C22 C23 C27-C29 = SparkFun:CAP: Capacitor Standard 0603 ceramic capacitor, and 0.1" leaded capacitor.
C11 C15 C19 C20 = SparkFun-Capacitors:CAP_POL: Capacitor Polarized These are standard SMD and PTH capacitors. Normally 10uF, 47uF, and 100uF in electrolytic and tantalum varieties. Always verify the external diameter of the through hole cap, it varies with capacity, voltage, and manufacturer. The EIA devices should be standard.
C12-C14 C16 C17 C21 = SparkFun-Capacitors:CAP: Capacitor Standard 0603 ceramic capacitor, and 0.1" leaded capacitor.
D0 D1-D3 LED1-LED11 LERROR LRUN LSTART LSTAT1-LSTAT4 LSTOP PWR_LED = SparkFun:LED: LEDs Standard schematic elements and footprints for 5mm, 3mm, 1206, and 0603 sized LEDs. 5mm - Spark Fun Electronics SKU : COM-00529 (and others)
JTAG = avr-7:AVR-JTAG-10: AVR JTAG Debug/Programming Header
L1 = SparkFun:INDUCTOR: Inductors Basic Inductor/Choke - 0603 and 1206. Footprints are not proven and vary greatly between part numbers.
MCU = uniq-at32uc3c:AT32UC3C1: ATMEL 32-bit Microcontroller 64KB, 128KB, 256KB, 512KB 100-pin TQFP (81 GPIO pins) http://www.atmel.com/Images/32117s.pdf; FLASH: 512KB
MODEBTN1-MODEBTN4 RESET = SparkFun-Electromechanical:SWITCH-MOMENTARY-2: Various NO switches- pushbuttons, reed, etc; PROD_ID: SWCH-08441
POWER = pinhead:PINHD-2X8: PIN HEADER
PWR_12 = SparkFun-LED:LED: LEDs Standard schematic elements and footprints for 5mm, 3mm, 1206, and 0603 sized LEDs. 5mm - Spark Fun Electronics SKU : COM-00529 (and others)
R1-R6 R8 R10-R14 R17-R20 R23 R24 R27 R28 R31-R55 R58-R64 R66 R83 = SparkFun:RESISTOR: Resistor Basic schematic elements and footprints for 0603, 1206, and PTH resistors.
R7 R26 R30 R65 = SparkFun-Resistors:RESISTOR-ARRAY: Array Chip Resistor Source: RS Component / Phycomp
R9 R22 R68 = SparkFun:RESISTOR-ARRAY: Array Chip Resistor Source: RS Component / Phycomp
R15 R16 R29 R56 = resistor:R-US_: RESISTOR, American symbol
R84 = SparkFun-Passives:RESISTOR: Resistor Basic schematic elements and footprints for 0603, 1206, and PTH resistors.
RJ45_0_ RJ45_1_ RJ45_2_ RJ45_3_ = Shell2013:2XETHERNET
U$1 = openlog:OPENLOG
U$2 = Shell2013:10X1PCBBLOCK
U$4 U$36 = Shell2013:MCP2551
U$5 U$6 U$8 U$10 U$12 U$14 U$16 U$18 U$19 U$21 U$39 = Shell2013:SIA426DJ
U$13 U$15 U$17 U$20 U$23 U$24 = diode:DIODE-: DIODE
V1-V3 = 74ttl-din:74*08: Quad 2-input AND gate